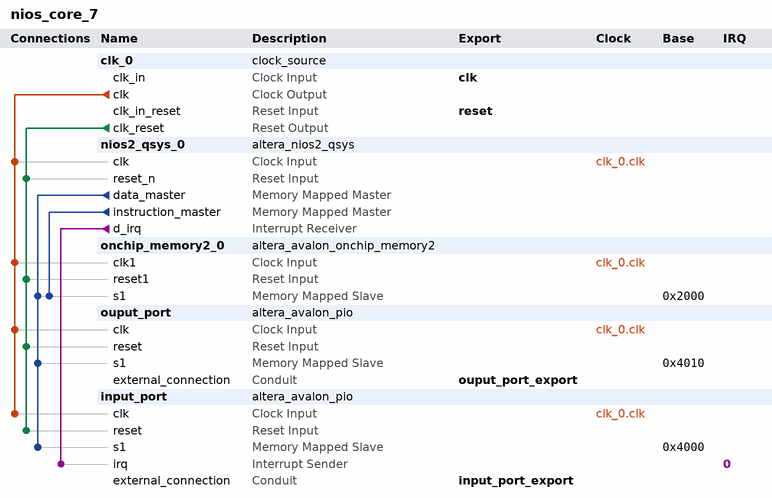
[diagram p0: system contents]
# Platform Designer (Qsys) system nios_core_7, Cyclone V 5CSEMA5F31C6
# Parameters at their usual value, and those the tool derives, are not listed.
package require -exact qsys 17.0
create_system nios_core_7
set_project_property DEVICE_FAMILY {Cyclone V}
set_project_property DEVICE 5CSEMA5F31C6

add_instance clk_0 clock_source 17.0
set_instance_parameter_value clk_0 clockFrequency 50000000

add_instance nios2_qsys_0 altera_nios2_qsys 16.1
set_instance_parameter_value nios2_qsys_0 breakSlave onchip_memory2_0.s1
set_instance_parameter_value nios2_qsys_0 debug_level NoDebug
set_instance_parameter_value nios2_qsys_0 exceptionSlave onchip_memory2_0.s1
set_instance_parameter_value nios2_qsys_0 icache_size 4096
set_instance_parameter_value nios2_qsys_0 impl Tiny
set_instance_parameter_value nios2_qsys_0 mmu_TLBMissExcSlave None
set_instance_parameter_value nios2_qsys_0 resetSlave onchip_memory2_0.s1
set_instance_parameter_value nios2_qsys_0 resetrequest_enabled false

add_instance onchip_memory2_0 altera_avalon_onchip_memory2 17.0
set_instance_parameter_value onchip_memory2_0 dataWidth 32
set_instance_parameter_value onchip_memory2_0 dualPort false
set_instance_parameter_value onchip_memory2_0 initMemContent true
set_instance_parameter_value onchip_memory2_0 initializationFileName C:/Users/alerner/Documents/BNB/Lab_5/phoenix/mirros_synthesis/nios_rom_7.hex
set_instance_parameter_value onchip_memory2_0 memorySize 8192
set_instance_parameter_value onchip_memory2_0 useNonDefaultInitFile true

add_instance ouput_port altera_avalon_pio 17.0
set_instance_parameter_value ouput_port direction Output
set_instance_parameter_value ouput_port width 18

add_instance input_port altera_avalon_pio 17.0
set_instance_parameter_value input_port direction Input
set_instance_parameter_value input_port generateIRQ true
set_instance_parameter_value input_port width 18

# connections
add_connection clk_0.clk input_port.clk clock
add_connection clk_0.clk nios2_qsys_0.clk clock
add_connection clk_0.clk onchip_memory2_0.clk1 clock
add_connection clk_0.clk ouput_port.clk clock
add_connection clk_0.clk_reset input_port.reset reset
add_connection clk_0.clk_reset nios2_qsys_0.reset_n reset
add_connection clk_0.clk_reset onchip_memory2_0.reset1 reset
add_connection clk_0.clk_reset ouput_port.reset reset
add_connection nios2_qsys_0.data_master input_port.s1 avalon
set_connection_parameter_value nios2_qsys_0.data_master/input_port.s1 baseAddress 0x4000
add_connection nios2_qsys_0.data_master onchip_memory2_0.s1 avalon
set_connection_parameter_value nios2_qsys_0.data_master/onchip_memory2_0.s1 baseAddress 0x2000
add_connection nios2_qsys_0.data_master ouput_port.s1 avalon
set_connection_parameter_value nios2_qsys_0.data_master/ouput_port.s1 baseAddress 0x4010
add_connection nios2_qsys_0.instruction_master onchip_memory2_0.s1 avalon
set_connection_parameter_value nios2_qsys_0.instruction_master/onchip_memory2_0.s1 baseAddress 0x2000
add_connection nios2_qsys_0.d_irq input_port.irq interrupt
set_connection_parameter_value nios2_qsys_0.d_irq/input_port.irq irqNumber 0

# exported interfaces
add_interface clk clock sink
set_interface_property clk EXPORT_OF clk_0.clk_in
add_interface input_port_export conduit end
set_interface_property input_port_export EXPORT_OF input_port.external_connection
add_interface ouput_port_export conduit end
set_interface_property ouput_port_export EXPORT_OF ouput_port.external_connection
add_interface reset reset sink
set_interface_property reset EXPORT_OF clk_0.clk_in_reset

set_interconnect_requirement {$system} qsys_mm.clockCrossingAdapter HANDSHAKE
set_interconnect_requirement {$system} qsys_mm.enableEccProtection FALSE
set_interconnect_requirement {$system} qsys_mm.insertDefaultSlave FALSE
set_interconnect_requirement {$system} qsys_mm.maxAdditionalLatency 1

save_system nios_core_7.qsys
